# EAGLE schematic riffle-0.4lp (EAGLE 7.2.0)
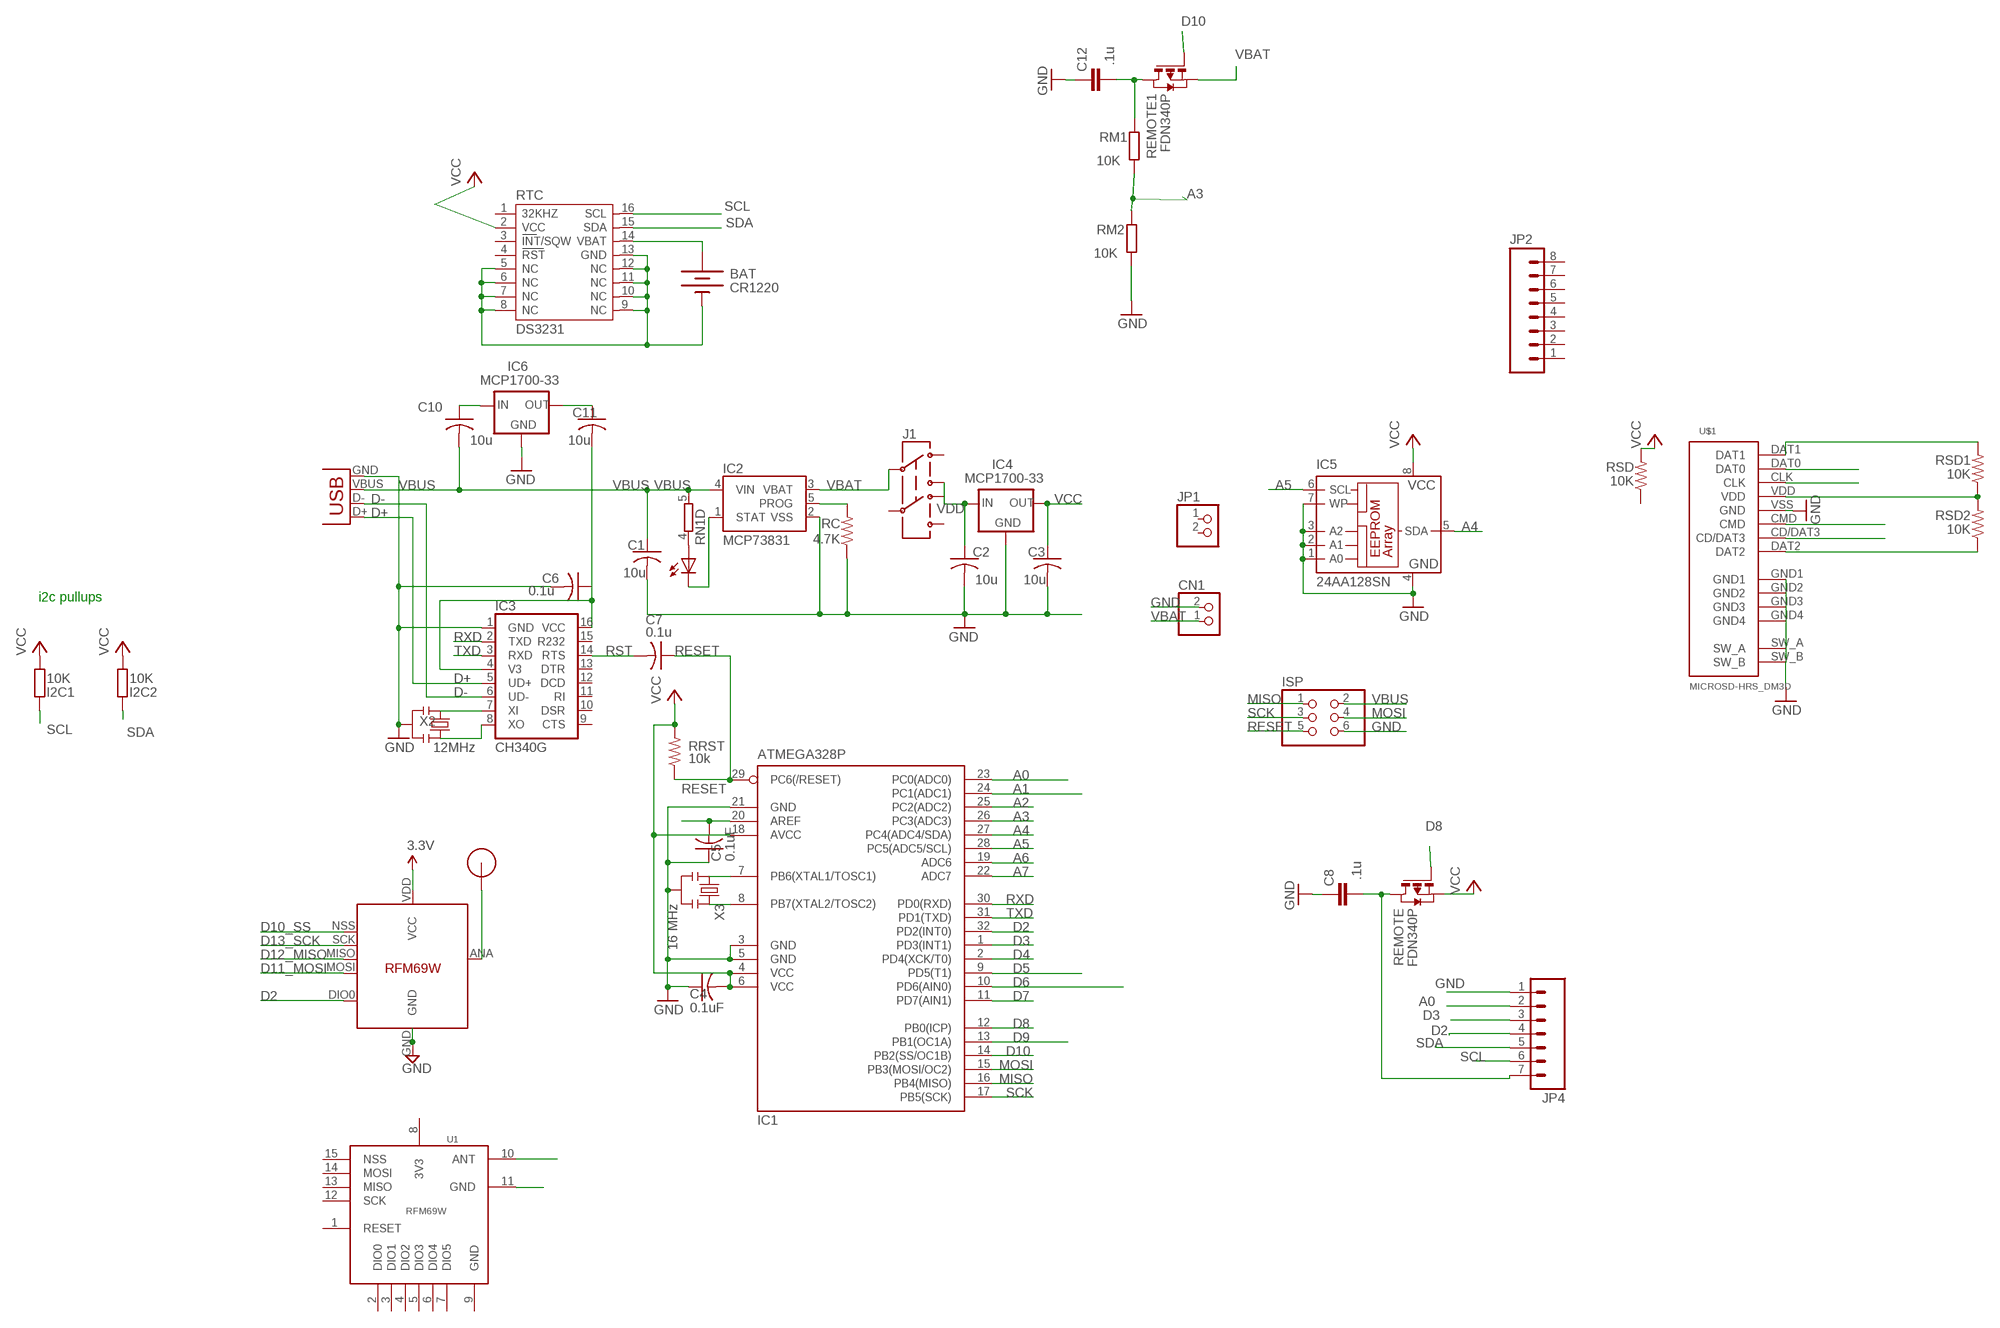
[diagram p0: schematic, sheet 1]

## Parts
BAT  CR1220  BATTERYBATTERY_12MM_SMT  [BATTCON_12MM_SMT]
C1  10u  C-USC0805K  [C0805K]
C2  10u  C-USC0805K  [C0805K]
C3  10u  C-USC0805K  [C0805K]
C4  0.1uF  C-USC0805K  [C0805K]
C5  0.1uF  C-USC0805K  [C0805K]
C6  0.1u  C-USC0805K  [C0805K]
C7  0.1u  C-USC0805K  [C0805K]
C8  .1u  C-EUC0805  [C0805]
C10  10u  C-USC0805K  [C0805K]
C11  10u  C-USC0805K  [C0805K]
C12  .1u  C-EUC0805  [C0805]
CHG  0805  LEDCHIPLED_0805  [CHIPLED_0805]
CN1  JST_2PIN-SMT-RA  [JST-PH-2-SMT-RA]
I2C1  10K  R-EU_R0805  [R0805]
I2C2  10K  R-EU_R0805  [R0805]
IC1  ATMEGA328P  MEGA8-AI  [TQFP32-08]
IC2  MCP73831  [SOT23-5]
IC3  CH340G  [SO16]
IC4  MCP1700-33  MCP1700SOT89  [SOT89]
IC5  24AA128SN  [SO-08]
IC6  MCP1700-33  MCP1700SOT89  [SOT89]
ISP  PINHD-2X3  [2X03]
J1  AYZ0202  [AYZ0202]
JP1  PINHD-1X2  [1X02]
JP2  M08  [1X08_ROUND]
JP4  M07  [1X07]
RC  4.7K  R-US_R0805  [R0805]
REMOTE  FDN340P  PMOSSOT23  [SOT-23]
REMOTE1  FDN340P  PMOSSOT23  [SOT-23]
RM1  10K  R-EU_R0805  [R0805]
RM2  10K  R-EU_R0805  [R0805]
RN1  4R-NEXB38V  [EXB38V]
RRST  10k  R-US_R0805  [R0805]
RSD  10K  R-US_R0603  [R0603]
RSD1  10K  R-US_R0603  [R0603]
RSD2  10K  R-US_R0603  [R0603]
RTC  DS3231  [DS3231]
U1  RFM69W  [RFM69W]
U$1  MICROSD-HRS_DM3D  [DM3D]
U$3  RFM12B_ANTENNA  [RFM12B-ANTENNA]
U$5  RFM69  [RFM69W-MINPADS]
X1  USBSMD  [USB-MINIB]
X2  12MHz  RESONATORSMD  [RESONATOR-SMD]
X3  16 MHz  RESONATORSMD  [RESONATOR-SMD]

## Nets
A0: IC1.23(PC0(ADC0)) JP4.2
A1: IC1.24(PC1(ADC1))
A2: IC1.25(PC2(ADC2))
A3: IC1.26(PC3(ADC3)) RM1.1 RM2.2
A4: IC1.27(PC4(ADC4/SDA)) IC5.5(SDA)
A5: IC1.28(PC5(ADC5/SCL)) IC5.6(SCL)
A6: IC1.19(ADC6)
A7: IC1.22(ADC7)
AREF: C5.2 IC1.20(AREF)
D2: IC1.32(PD2(INT0)) JP4.4 U$5.DIO0
D3: IC1.1(PD3(INT1)) JP4.3
D4: IC1.2(PD4(XCK/T0))
D5: IC1.9(PD5(T1))
D6: IC1.10(PD6(AIN0))
D7: IC1.11(PD7(AIN1))
D8: IC1.12(PB0(ICP)) REMOTE.3(G)
D9: IC1.13(PB1(OC1A))
D10: IC1.14(PB2(SS/OC1B)) REMOTE1.3(G)
D10_SS: U$5.NSS(SEL)
D11_MOSI: U$5.MOSI
D12_MISO: U$5.MISO
D13_SCK: U$5.SCK
D+: IC3.5(UD+) X1.D+
D-: IC3.6(UD-) X1.D-
GND: BAT.P$1(-) C1.2 C2.2 C3.2 C4.1 C5.1 C6.2 C8.1 C12.1 CN1.2 IC1.3(GND) IC1.5(GND) IC1.21(GND) IC2.2(VSS) IC3.1(GND) IC4.1(GND) IC5.1(A0) IC5.2(A1) IC5.3(A2) IC5.4(GND) IC5.7(WP) IC6.1(GND) ISP.6 JP4.1 RC.1 RM2.1 RTC.5(NC) RTC.6(NC) RTC.7(NC) RTC.8(NC) RTC.9(NC) RTC.10(NC) RTC.11(NC) RTC.12(NC) RTC.13(GND) U$1.GND1 U$1.GND2 U$1.GND3 U$1.GND4 U$1.SW_A U$1.SW_B U$1.VSS(GND) U$5.GND X1.GND X2.2 X3.2
MISO: IC1.16(PB4(MISO)) ISP.1
MOSI: IC1.15(PB3(MOSI/OC2)) ISP.4
N$1: U$3.P$1 U$5.ANA(ANT)
N$2: IC1.7(PB6(XTAL1/TOSC1)) X3.1
N$3: IC1.8(PB7(XTAL2/TOSC2)) X3.3
N$4: C6.1 IC3.4(V3) IC3.16(VCC)
N$5: CHG.C IC2.1(STAT)
N$6: IC2.5(PROG) RC.2
N$7: C8.2 JP4.7 REMOTE.1(D)
N$8: C11.1 IC6.3(OUT)
N$9 [vcc]: C10.1 IC6.2(IN)
N$10: CHG.A RN1.4
N$11: IC3.7(XI) X2.1
N$12: U1.10(ANT)
N$13: IC3.8(XO) X2.3
N$14: U1.11(GND)
N$15: C12.2 REMOTE1.1(D) RM1.2
N$16: RSD1.2 U$1.DAT1
N$17: RSD1.1 RSD2.2 U$1.VDD
N$18: RSD2.1 U$1.DAT2
N$19: U$1.CD/DAT3
N$20: U$1.CMD
N$21: U$1.CLK
N$22: U$1.DAT0
RESET: C7.1 IC1.29(PC6(/RESET)) ISP.5 RRST.1
RST: C7.2 IC3.14(RTS)
RTC_BATT: BAT.P$2(+) RTC.14(VBAT)
RXD: IC1.30(PD0(RXD)) IC3.2(TXD)
SCK: IC1.17(PB5(SCK)) ISP.3
SCL: I2C1.2 JP4.6 RTC.16(SCL)
SDA: I2C2.2 JP4.5 RTC.15(SDA)
TXD: IC1.31(PD1(TXD)) IC3.3(RXD)
VBAT [vcc]: CN1.1 IC2.3(VBAT) J1.2 REMOTE1.2(S)
VBUS [vcc]: C1.1 C10.2 IC2.4(VIN) ISP.2 RN1.5 X1.VBUS
VCC: C3.1 C4.2 I2C1.1 I2C2.1 IC1.4(VCC) IC1.6(VCC) IC1.18(AVCC) IC4.3(OUT) IC5.8(VCC) REMOTE.2(S) RRST.2 RSD.2 RTC.2(VCC) U$5.VDD(VCC) ; supply symbol labelled 3.3V
VDD: C2.1 IC4.2(IN) J1.1
Unconnected: C11.2 IC3.9(CTS) IC3.10(DSR) IC3.11(RI) IC3.12(DCD) IC3.13(DTR) IC3.15(R232) J1.3 J1.4 J1.5 J1.6 JP1.1 JP1.2 JP2.1 JP2.2 JP2.3 JP2.4 JP2.5 JP2.6 JP2.7 JP2.8 RN1.1 RN1.2 RN1.3 RN1.6 RN1.7 RN1.8 RSD.1 RTC.1(32KHZ) RTC.3(INT/SQW) RTC.4(RST) U1.1(RESET) U1.2(DIO0) U1.3(DIO1) U1.4(DIO2) U1.5(DIO3) U1.6(DIO4) U1.7(DIO5) U1.8(3V3) U1.9(GND) U1.12(SCK) U1.13(MISO) U1.14(MOSI) U1.15(NSS)

## Notes on the sheet
- i2c pullups

## Library data of the parts
BAT = SparkFunNew:BATTERY: Battery Holders Various common sizes : AA, AAA, 20mm coin cell and 12mm coin cell.
C1-C5 C10 C11 = adafruit2013:C-US: CAPACITOR, American symbol
C6 C7 = adafruit:C-US: CAPACITOR, American symbol
C8 C12 = resistor:C-EU: CAPACITOR, European symbol
CHG = led:LED: LED OSRAM: - CHIPLED LG R971, LG N971, LY N971, LG Q971, LY Q971, LO R971, LY R971 LH N974, LH R974 LS Q976, LO Q976, LY Q976 LO Q996 - Hyper CHIPLED LW Q18S LB Q993, LB Q99A, LB R99A - SideLED LS A670, LO A670, LY A670, LG A670, LP A670 LB A673, LV A673, LT A673, LW A673 LH A674 LY A675 LS A676, LA A676, LO A676, LY A676, LW A676 LS A679, LY A679, LG A679 - Hyper Micro SIDELED® LS Y876, LA Y876, LO Y876, LY Y876 LT Y87S - SmartLED LW L88C, LW L88S LB L89C, LB L89S, LG L890 LS L89K, LO L89K, LY L89K LS L896, LA L896, LO L896, LY L896 - TOPLED LS T670, LO T670, LY T670, LG T670, LP T670 LSG T670, LSP T670, LSY T670, LOP T670, LYG T670 LG T671, LOG T671, LSG T671 LB T673, LV T673, LT T673, LW T673 LH T674 LS T676, LA T676, LO T676, LY T676, LB T676, LH T676, LSB T676, LW T676 LB T67C, LV T67C, LT T67C, LS T67K, LO T67K, LY T67K, LW E67C LS E67B, LA E67B, LO E67B, LY E67B, LB E67C, LV E67C, LT E67C LW T67C LS T679, LY T679, LG T679 LS T770, LO T770, LY T770, LG T770, LP T770 LB T773, LV T773, LT T773, LW T773 LH T774 LS E675, LA E675, LY E675, LS T675 LS T776, LA T776, LO T776, LY T776, LB T776 LHGB T686 LT T68C, LB T68C - Hyper Mini TOPLED® LB M676 - Mini TOPLED Santana® LG M470 LS M47K, LO M47K, LY M47K Source: http://www.osram.convergy.de LUXEON: - LUMILED® LXK2-PW12-R00, LXK2-PW12-S00, LXK2-PW14-U00, LXK2-PW14-V00 LXK2-PM12-R00, LXK2-PM12-S00, LXK2-PM14-U00 LXK2-PE12-Q00, LXK2-PE12-R00, LXK2-PE12-S00, LXK2-PE14-T00, LXK2-PE14-U00 LXK2-PB12-K00, LXK2-PB12-L00, LXK2-PB12-M00, LXK2-PB14-N00, LXK2-PB14-P00, LXK2-PB14-Q00 LXK2-PR12-L00, LXK2-PR12-M00, LXK2-PR14-Q00, LXK2-PR14-R00 LXK2-PD12-Q00, LXK2-PD12-R00, LXK2-PD12-S00 LXK2-PH12-R00, LXK2-PH12-S00 LXK2-PL12-P00, LXK2-PL12-Q00, LXK2-PL12-R00 Source: www.luxeon.com KINGBRIGHT: KA-3528ASYC Source: www.kingbright.com
CN1 = adafruit:JST_2PIN: JST 2-Pin Connectors of various flavors SMT-RA (S2B-PH-SM4) 4UConnector #17311 SMT (B2B-PH-SM4) THM-RA (S2B-PH) THM (B2B-PH)
I2C1 I2C2 RM1 RM2 = rcl:R-EU_: RESISTOR, European symbol
IC1 = atmel:MEGA8: MICROCONTROLLER 8 Kbytes FLASH, 1 kbytes SRAM, 512 bytes EEPROM, USART, 6-channel 10 bit ADC, 2-channel 8 bit ADC Pin compatible with Atmega48, ATMega88, ATMega168 Source: avr.lbr; MPN: ATMEGA8-16AU; OC_FARNELL: 9171371; OC_NEWARK: 73M8863
IC2 = SparkFunNew:MCP73831: Microchip's MCP73831 Miniature single cell, fully integrated Li-Ion, Li-polymer charge management controller http://ww1.microchip.com/downloads/en/DeviceDoc/21984a.pdf
IC3 = SparkFunNew:CH340
IC4 IC6 = adafruit:MCP1700: VOLTAGE REGULATOR
IC5 = microchip:24*: Serial EEPROM I2C; MF: MICROCHIP; MPN: 24AA128-I/SN; OC_FARNELL: unknown; OC_NEWARK: 92C6842
ISP = pinhead:PINHD-2X3: PIN HEADER
J1 = SparkFunNew:AYZ0202: SPDT Slide Switch Simple SMD single-pull double-throw slide switch. Good for less than 350mA power switch, switching UARTs between devices, etc. Spark Fun Electronics SKU : COM-00597
JP1 = pinhead:PINHD-1X2: PIN HEADER
JP2 = SparkFun-Connectors:M08: Header 8 Standard 8-pin 0.1" header. Use with straight break away headers (SKU : PRT-00116), right angle break away headers (PRT-00553), swiss pins (PRT-00743), machine pins (PRT-00117), and female headers (PRT-00115).
JP4 = SparkFun-Connectors:M07: Header 7 Standard 7-pin 0.1" header. Use with straight break away headers (SKU : PRT-00116), right angle break away headers (PRT-00553), swiss pins (PRT-00743), machine pins (PRT-00117), and female headers (PRT-00115). NOTES ON THE VARIANTS LOCK and LOCK_LONGPADS... This footprint was designed to help hold the alignment of a through-hole component (i.e. 7-pin header) while soldering it into place. You may notice that each hole has been shifted either up or down by 0.005 of an inch from it's more standard position (which is usually a perfectly straight line). This slight alteration caused the pins (the squares in the middle) to touch the edges of the holes. Because they are alternating, it causes a "brace" to hold the header in place. 0.005 has proven to be the perfect amount of "off-center" position when using our standard breakaway headers. Although looks a little odd when you look at the bare footprint, once you have a header in there, the alteration is very hard to notice. Also, if you push a header all the way into place, it is covered up entirely on the bottom side. This idea of altering the position of holes to aid alignment will be further integrated into the Sparkfun Library for other footprints. It can help hold any component with 3 or more connection pins.
RC RRST RSD RSD1 RSD2 = adafruit2013:R-US_: RESISTOR, American symbol
REMOTE REMOTE1 = zetex:PMOSSOT23: MOS FET
RN1 = resistor-dil:4R-N: Array Chip Resistor Source: RS Component / Phycomp; OC_FARNELL: unknown; OC_NEWARK: unknown
RTC = _lh-library:DS3231
U1 = ChipsParts:RFM69W: Radio Transceiver Module, FSK, 433, 848, 915 MHz, SPI controlled, Mfr=HopeRF
U$1 = hrs_DM3D-SF:MICROSD-HRS_DM3D
U$3 = LowPowerLab:RFM12B_ANTENNA
U$5 = LowPowerLab:RFM69
X1 = SparkFun:USB: USB Connectors USB-B-PTH is fully proven SKU : PRT-00139 USB-miniB is fully proven SKU : PRT-00587 USB-A-PCB is untested. USB-A-H is throughly reviewed, but untested. Spark Fun Electronics SKU : PRT-00437 USB-B-SMT is throughly reviewed, but untested. Needs silkscreen touching up. USB-A-S has not been used/tested USB-MB-H has not been used/tested
X2 = SparkFunNew:RESONATOR: Resonator Small SMD resonator. This is the itty bitty 10/20MHz resonators with built in caps. CSTCE10M0G55 and CSTCE20M0V53. Footprint has been reviewed closely but hasn't been tested yet.
X3 = SparkFun:RESONATOR: Resonator Small SMD resonator. This is the itty bitty 10/20MHz resonators with built in caps. CSTCE10M0G55 and CSTCE20M0V53. Footprint has been reviewed closely but hasn't been tested yet.